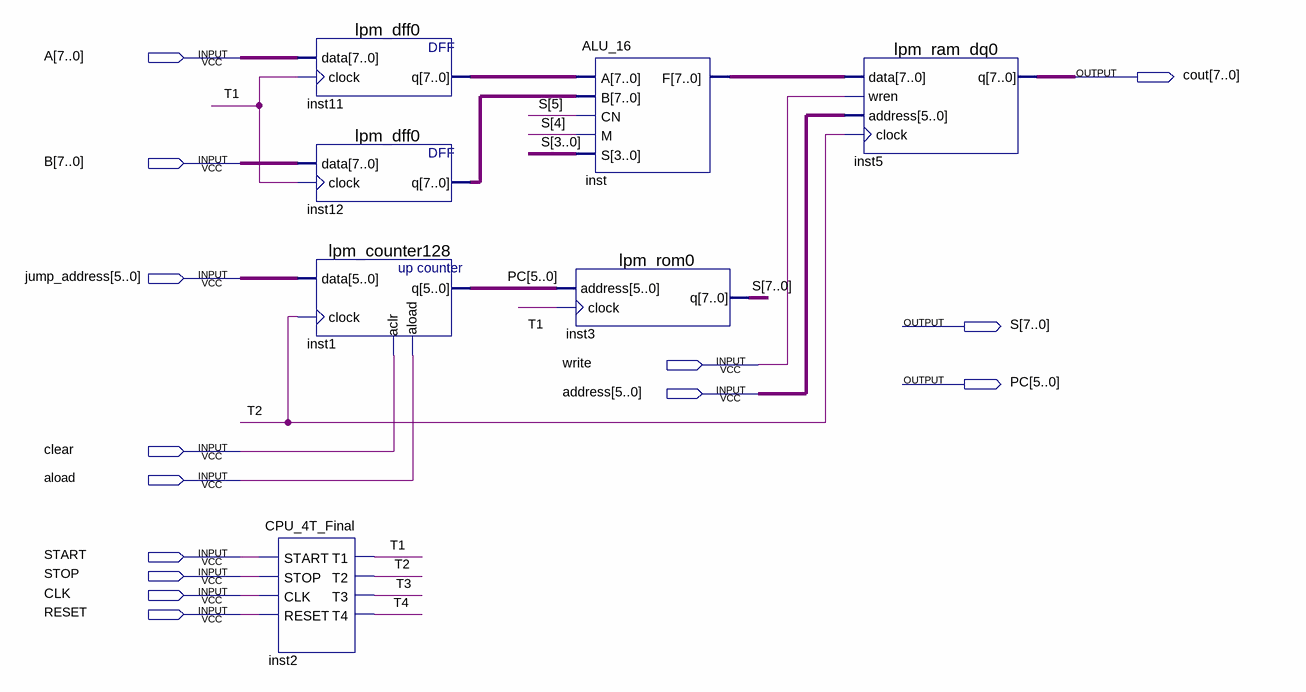
[diagram p0: schematic sheet]
// Quartus schematic CPU_4T&ALU_8.bdf as structural Verilog: 7 symbols, 14 pins
module \CPU_4T&ALU_8  (
  input  [7:0] A,
  input  [7:0] B,
  input  [5:0] jump_address,
  input  write,
  input  [5:0] address,
  input  clear,
  input  aload,
  input  START,
  input  STOP,
  input  CLK,
  input  RESET,
  output [7:0] cout,
  output [7:0] S,
  output [5:0] PC
);

  wire T1, T2, T3, T4;
  wire [7:0] inst11_q, inst12_q, inst_f;

  CPU_4T_Final inst2 (.START(START), .STOP(STOP), .CLK(CLK), .RESET(RESET), .T1(T1), .T2(T2), .T3(T3), .T4(T4));
  lpm_dff0 inst11 (.data(A), .clock(T1), .q(inst11_q));
  lpm_dff0 inst12 (.data(B), .clock(T1), .q(inst12_q));
  lpm_counter128 inst1 (.data(jump_address), .clock(T2), .aclr(clear), .aload(aload), .q(PC));
  ALU_16 inst (.A(inst11_q), .B(inst12_q), .CN(S[5]), .M(S[4]), .S(S[3:0]), .F(inst_f));
  lpm_rom0 inst3 (.address(PC), .clock(T1), .q(S));
  lpm_ram_dq0 inst5 (.data(inst_f), .wren(write), .address(address), .clock(T2), .q(cout));
endmodule
